# Altium schematic sheet Cockpit.SchDoc
size A4; SheetNumber: 1; SheetTotal: 1
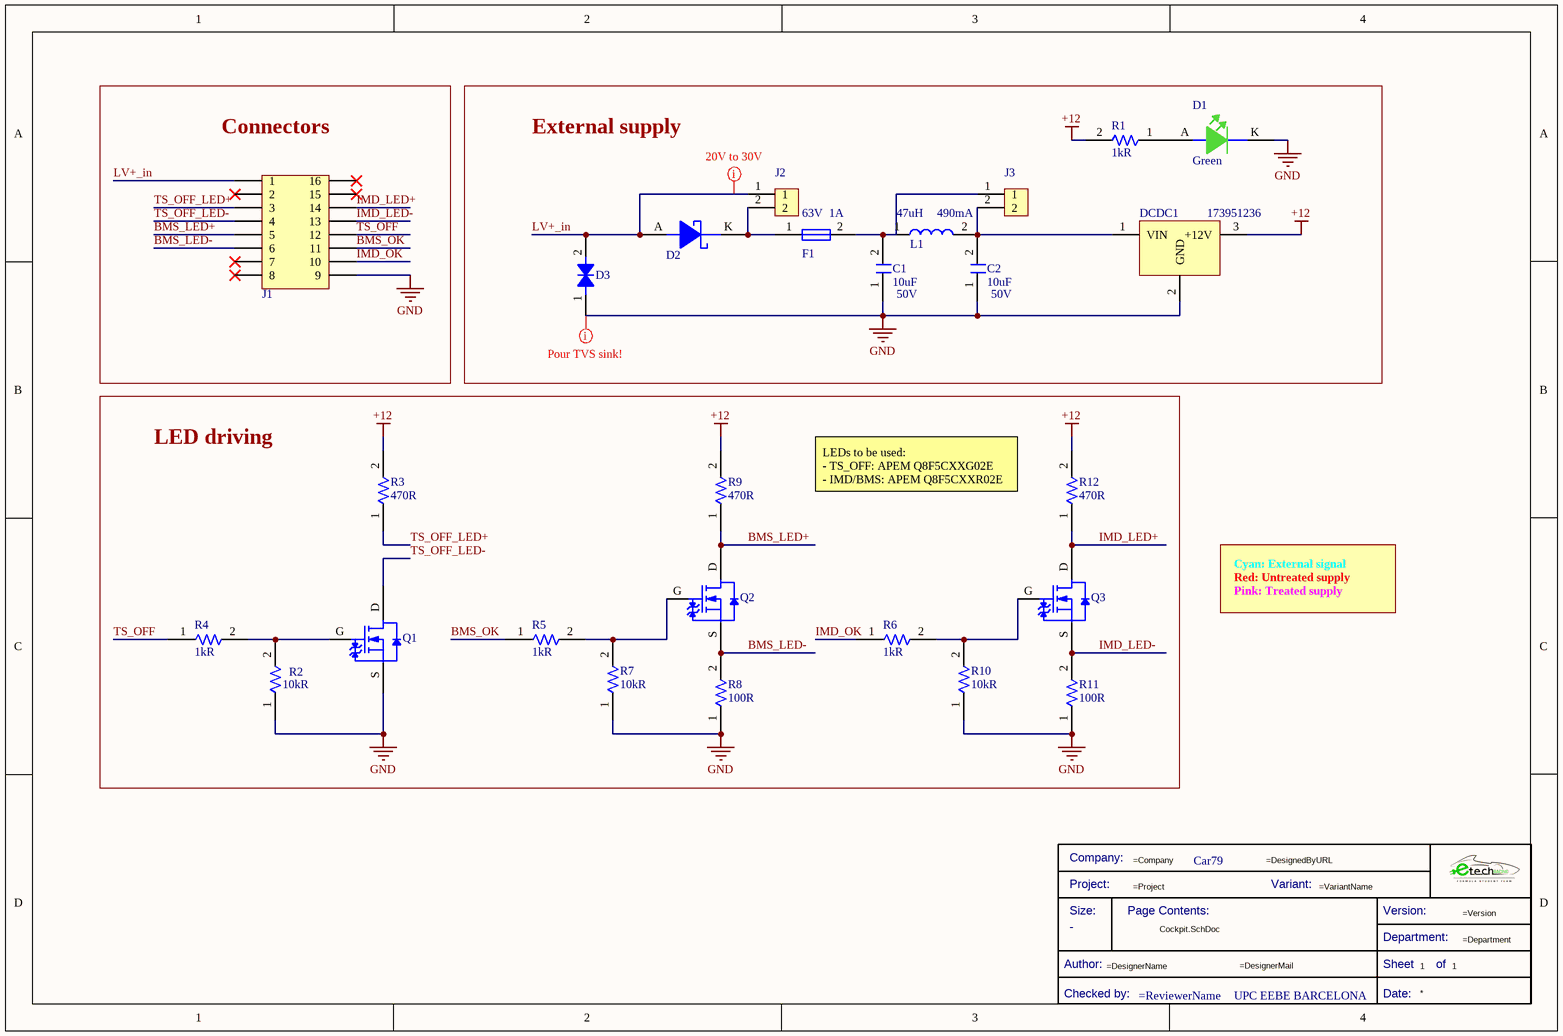
[diagram p0: Cockpit.SchDoc]

## Parts
*  Title Block_template  (value not drawn)  (graphical)
C1  Voltage Rating: 50V  Capacitance: 10uF  [C10u-50V-1210FNPMLCC-X7R]  (hidden comment: GRJ32ER71H106KE11L)
C2  Voltage Rating: 50V  Capacitance: 10uF  [C10u-50V-1210FNPMLCC-X7R]  (hidden comment: GRJ32ER71H106KE11L)
D1  Color: Green  [LED_0805_WE]  (hidden comment: 150080VS75000)
D2  MBR0530  [DSC-SOD123]  (value not drawn)
D3  824551301  [DTVS-DO-214AB]  (value not drawn)
DCDC1  173951236  [DCDC_Magi3c]
F1  Current Rating: 1A  Voltage Rating (DC): 63V  [Fuse_1206]  (hidden comment: 0437001.WRA)
J1  1053141116  [J_NanoFit_2x8]  (value not drawn)
J2  61300211121  [J_Pinheader_1x2]  (value not drawn)
J3  61300211121  [J_Pinheader_1x2]  (value not drawn)
L1  Current Rating: 490mA  Inductance: 47uH  [L_47u-490mA_CF]  (hidden comment: CDC5D23BNP-470KC)
Q1  CPH3455-TL-H  [TRT-NCH-3/35-CPH]  (value not drawn)
Q2  CPH3455-TL-H  [TRT-NCH-3/35-CPH]  (value not drawn)
Q3  CPH3455-TL-H  [TRT-NCH-3/35-CPH]  (value not drawn)
R1  Resistance: 1kR  [R0805FTK]  (hidden comment: CR0805-JW-102ELF)
R2  Resistance: 10kR  [R0805FTK]  (hidden comment: CR0805-JW-103ELF)
R3  Resistance: 470R  [R0805FTK]  (hidden comment: CR0805-FX-4700GLF)
R4  Resistance: 1kR  [R0805FTK]  (hidden comment: CR0805-JW-102ELF)
R5  Resistance: 1kR  [R0805FTK]  (hidden comment: CR0805-JW-102ELF)
R6  Resistance: 1kR  [R0805FTK]  (hidden comment: CR0805-JW-102ELF)
R7  Resistance: 10kR  [R0805FTK]  (hidden comment: CR0805-JW-103ELF)
R8  Resistance: 100R  [R0805FTK]  (hidden comment: CR0805-FX-1000ELF)
R9  Resistance: 470R  [R0805FTK]  (hidden comment: CR0805-FX-4700GLF)
R10  Resistance: 10kR  [R0805FTK]  (hidden comment: CR0805-JW-103ELF)
R11  Resistance: 100R  [R0805FTK]  (hidden comment: CR0805-FX-1000ELF)
R12  Resistance: 470R  [R0805FTK]  (hidden comment: CR0805-FX-4700GLF)

## Blocks framed on the sheet
Connectors: J1
External supply: C1 C2 D1-D3 DCDC1 F1 J2 J3 L1 R1
LED driving: Q1-Q3 R2-R12

## Nets
+12: DCDC1.3(+12V) R1.2 R3.2 R9.2 R12.2
GND: C1.1 C2.1 D1.K D3.1 DCDC1.2(GND) J1.9 Q1.S R2.1 R7.1 R8.1 R10.1 R11.1
BMS_LED+: J1.5 Q2.D R9.1
BMS_LED-: J1.6 Q2.S R8.2
BMS_OK: J1.11 R5.1
IMD_LED+: J1.14 Q3.D R12.1
IMD_LED-: J1.13 Q3.S R11.2
IMD_OK: J1.10 R6.1
LV+_in: D2.A D3.2 J1.1 J2.1
TS_OFF: J1.12 R4.1
TS_OFF_LED+: J1.3 R3.1
TS_OFF_LED-: J1.4 Q1.D
NetC1_2: C1.2 F1.2 J3.1 L1.1
NetC2_2: C2.2 DCDC1.1(VIN) J3.2 L1.2
NetD1_A: D1.A R1.1
NetD2_K: D2.K F1.1 J2.2
NetQ1_G: Q1.G R2.2 R4.2
NetQ2_G: Q2.G R5.2 R7.2
NetQ3_G: Q3.G R6.2 R10.2

Not connected (* = marked no-connect by the designer): J1 2* 7* 8* 15* 16*

## Layout directives
mark named Pour TVS sink!: GND
mark named 20V to 30V: LV+_in

## Notes on the sheet
- LEDs to be used:
  - TS_OFF: APEM Q8F5CXXG02E
  - IMD/BMS: APEM Q8F5CXXR02E
- Cyan: External signal
- Red: Untreated supply
- Pink: Treated supply
- Car79
- UPC EEBE BARCELONA
- (in symbol Title Block_template) Company:; Project:; Variant:; Size:; Page Contents:; Version:; Department:; Author:; Sheet; of; Checked by:; Date:

## Library data of the parts
* = Title Block_template: Standard Title Block; .Creator: GP; Category: Title Block; .PCBcheck: GP; .SCHcheck: GP; Checked by:: =ReviewerName; Size: -
C1 C2 = C10u-50V-1210FNPMLCC-X7R: Multilayer Ceramic Capacitors MLCC - SMD/SMT 1210 10uF 50volts X7R +/-10% Soft Term; Manufacturer: Murata; Tolerance: 10%; .Creator: DR; Supplier 1: Avnet; Manufacturer Part Number: GRJ32ER71H106KE11L; RoHS: Yes; Category: Ceramic Capacitors; Stock 1: 19000; Pricing 1: 1000=0,33327, 2000=0,32389, 4000=0,31450, 6000=0,30511, 8000=0,29572 (USD); Mount: Surface Mount; Case/Package: 1210; Case Code (Metric): 3225; Case Code (Imperial): 1210; Min Operating Temperature: -55°C; Max Operating Temperature: 125°C; Packaging: Tape and Reel; Features: Soft Termination; Length: 0.126inch; Width: 0.098inch; Thickness: 0.11inch; RoHS Compliant: Yes; ComponentLink1URL: https://eu.mouser.com/datasheet/2/281/GRJ32ER71H106KE11_01-1977929.pdf; ComponentLink1Description: Datasheet; Supplier Part Number 1: GRJ32ER71H106KE11L
D1 = LEDVS-0805-40: Led, Green, 570 Nm, 2 V, 30 Ma, 40 Mcd Rohs Compliant: Yes; Manufacturer 1: Wurth Electronics; Luminous Intensity: 40mcd; Forward Current: 30mA; Forward Voltage: 2V; Viewing Angle: 140°; Wavelength: 570nm; Lens Style: Clear,Rectangular; Test Current: 20mA; .Creator: DR; ComponentLink1Description: Datasheet; ComponentLink1URL: https://www.we-online.com/catalog/datasheet/150080VS75000.pdf; ComponentLink2Description: Where buy it; ComponentLink2URL: https://katalog.we-online.de/en/led/WL-SMCW/150080VS75000; Supplier 1: RSComponents; Manufacturer Part Number 1: 150080VS75000; RoHS: Yes; Category: LEDs; Stock 1: 850; Pricing 1: 50=0,19300, 500=0,12900, 1000=0,12300, 2000=0,11700, 4000=0,11100 (USD); Mount: Surface Mount; Case/Package: 0805; Case Code (Metric): 2012; Case Code (Imperial): 0805; Min Operating Temperature: -40°C; Max Operating Temperature: 85°C; Package Quantity: 4000; Packaging: Tape and Reel; Dominant Wavelength: 570nm; Length: 2mm; Width: 1.25mm; Height: 0.7mm; REACH SVHC: Unknown; ComponentLink3URL: https://datasheet.ciiva.com/22656/150080vs75000-22656966.pdf?src-supplier=Element14; ComponentLink3Description: https://datasheet.ciiva.com/22656/150080vs75000-22656966.pdf?src-supplier=Element14; ComponentLink4URL: https://datasheet.ciiva.com/29279/759437-da-01-en-chipled-0805-w-kl-h-gruen-150080vs7500-29279047.pdf?src-supplier=Conrad; ComponentLink4Description: https://datasheet.ciiva.com/29279/759437-da-01-en-chipled-0805-w-kl-h-gruen-150080vs7500-29279047.pdf?src-supplier=Conrad; ComponentLink5URL: https://datasheet.ciiva.com/29563/150080vs75000-29563018.pdf?src-supplier=Digi-Key; ComponentLink5Description: https://datasheet.ciiva.com/29563/150080vs75000-29563018.pdf?src-supplier=Digi-Key; Supplier Part Number 1: 8154237
D2 = DSC-0.5/30-SOD123: VR=30V IF=500mA 30pF P=410mW; Element Configuration: Single; Forward Voltage: 430mV; Peak Non-Repetitive Surge Current: 5.5A; Average Rectified Current: 500mA; Max Reverse Leakage Current: 130uA; Max Reverse Voltage (DC): 30V; Polarity: Standard; .Creator: GP; Category: Diode; ComponentLink1Description: Datasheet; ComponentLink1URL: *; ComponentLink2Description: Where buy it; ComponentLink2URL: *; Supplier 1: Newark; Stock 1: 9; Pricing 1: 1=0,34400, 10=0,23900, 100=0,12200, 500=0,10000 (USD); Mount: Surface Mount; Contact Plating: Tin,Matte; Weight: 0.03g; Package Quantity: 1; Max Surge Current: 5.5A; Forward Current: 500mA; Max Reverse Current: 130uA; Max Repetitive Reverse Voltage (Vrrm): 30V; Max Forward Surge Current (Ifsm): 5.5A; Voltage Rating (DC): 30V; Current Rating: 500mA; Output Current: 500mA; Series: -; Length: 2.7mm; Width: 1.6mm; Height: 1.03mm; Radiation Hardening: No; RoHS Compliant: Yes; REACH SVHC: No SVHC; Lead Free: Lead Free; ComponentLink3URL: https://datasheet.ciiva.com/30479/0900766b810e2512-30479401.pdf?src-supplier=RSComponents; ComponentLink3Description: https://datasheet.ciiva.com/30479/0900766b810e2512-30479401.pdf?src-supplier=RSComponents; ComponentLink4URL: https://datasheet.ciiva.com/34301/974753-34301826.pdf?src-supplier=Jameco; ComponentLink4Description: https://datasheet.ciiva.com/34301/974753-34301826.pdf?src-supplier=Jameco; ComponentLink5URL: https://datasheet.ciiva.com/910/mbr0530-910516.pdf?src-supplier=Digi-Key; ComponentLink5Description: https://datasheet.ciiva.com/910/mbr0530-910516.pdf?src-supplier=Digi-Key; ComponentLink6URL: https://datasheet.ciiva.com/25931/mbr0530-25931989.pdf?src-supplier=Avnet+Europe; ComponentLink6Description: https://datasheet.ciiva.com/25931/mbr0530-25931989.pdf?src-supplier=Avnet+Europe; ComponentLink7URL: https://datasheet.ciiva.com/8300/mbr0530-8300905.pdf?src-supplier=Avnet; ComponentLink7Description: https://datasheet.ciiva.com/8300/mbr0530-8300905.pdf?src-supplier=Avnet; ComponentLink8URL: https://datasheet.ciiva.com/17318/mbr0530-17318568.pdf?src-supplier=Future+Electronics; ComponentLink8Description: https://datasheet.ciiva.com/17318/mbr0530-17318568.pdf?src-supplier=Future+Electronics; ComponentLink9URL: https://datasheet.ciiva.com/15144/getdatasheetpartid-86760-15144598.pdf?src-supplier=Verical; ComponentLink9Description: https://datasheet.ciiva.com/15144/getdatasheetpartid-86760-15144598.pdf?src-supplier=Verical; ComponentLink10URL: https://datasheet.ciiva.com/910/mbr0530-910518.pdf?src-supplier=Digi-Key; ComponentLink10Description: https://datasheet.ciiva.com/910/mbr0530-910518.pdf?src-supplier=Digi-Key; Supplier Part Number 1: 15R3453
D3 = DTVS-40V-DO-214AB: TVS diode [Würth Elektronik] 824551301 TVS diode; Manufacturer: Wurth Electronics; Number of Bidirectional Channels: 1; Reverse Standoff Voltage: 30V; Min Breakdown Voltage: 35.05V; Clamping Voltage: 48.4V; Peak Pulse Power: 3kW; Power Line Protection: No; Polarity: Bidirectional; Peak Pulse Current: 62A; .Creator: DO; ComponentLink2Description: Where buy it; ComponentLink2URL: https://www.we-online.com/catalog/en/WE-TVSP?sq=824551301#824551301; Supplier 1: RSComponents; Manufacturer Part Number: 824551301; RoHS: Yes; Category: TVS Diodes; Stock 1: 1; Pricing 1: 10=1,72500, 50=1,54700, 100=1,45300, 250=1,35100, 500=1,15000 (USD); Mount: Surface Mount; Number of Pins: 2; Min Operating Temperature: -65°C; Max Operating Temperature: 150°C; Packaging: Cut Tape; Max Breakdown Voltage: 35.05V; Resistor Type: Zener; REACH SVHC: Unknown; RoHS Compliant: Yes; ComponentLink1URL: http://www.farnell.com/datasheets/2036459.pdf?src-supplier=Element14; ComponentLink1Description: http://www.farnell.com/datasheets/2036459.pdf?src-supplier=Element14; Supplier Part Number 1: 9217092P
DCDC1 = DCDC-36V/12V-0.5A: Fdsm Fixed Step Down Regulator M; Manufacturer 1: Wurth Electronics; Supplier 1: Digi-Key; Manufacturer Part Number 1: 173951236; RoHS: No; Category: Board Mount Modules; Stock 1: 32; Pricing 1: 1=3,29000, 10=2,99100, 20=2,81300, 30=2,63600, 43=2,39907 (USD); Supplier Part Number 1: 732-173951236-ND; ComponentLink1Description: Datasheet; ComponentLink1URL: https://www.we-online.com/catalog/datasheet/173951236.pdf
F1 = Fuse_1A_63V_1206: Fuse Chip Fast Acting 1A 63V SMD Solder Pad 1206 Ceramic T/R Automotive; Manufacturer: Littelfuse; Fuse Type: Board Mount (Cartridge Style Excluded); Approvals: CSA,cURus; .Creator: DO; Supplier 1: Digi-Key; Manufacturer Part Number: 0437001.WRA; RoHS: Yes; Category: Fuses; Stock 1: 5820; Pricing 1: 1=1,52000, 5=1,47000, 10=1,37600, 50=1,13860, 100=0,94880, 250=0,92508, 500=0,78276, 1000=0,68788 (USD); Mount: Surface Mount; Case/Package: 1206; Case Code (Imperial): 1206; Case Code (Metric): 3216; Min Operating Temperature: -55°C; Max Operating Temperature: 150°C; Packaging: Tape and Reel; Voltage Rating (AC): 63V; ComponentLink1URL: https://www.littelfuse.com/~/media/electronics/datasheets/fuses/littelfuse_fuse_437a_datasheet.pdf.pdf?src-supplier=Digi-Key; ComponentLink1Description: https://www.littelfuse.com/~/media/electronics/datasheets/fuses/littelfuse_fuse_437a_datasheet.pdf.pdf?src-supplier=Digi-Key; Supplier Part Number 1: F10001CT-ND; ComponentLink2Description: Where buy it; ComponentLink2URL: https://www.mouser.es/ProductDetail/Littelfuse/0437001WRA?qs=DXv0QSHKF4z9CJhPXjxR%252BA%3D%3D
J1 = J_NanoFit_2x8: Nano-Fit Right Angle Header Through Hole 2.50mm Pitch Dual Row 16 Circuits Tin (Sn) Plating Black; Manufacturer: Molex; Manufacturer Part Number: 105314-1116; .Creator: DO; ComponentLink1URL: https://www.molex.com/pdm_docs/ps/PS-105300-100-001.pdf?src-supplier=Digi-Key; ComponentLink1Description: https://www.molex.com/pdm_docs/ps/PS-105300-100-001.pdf?src-supplier=Digi-Key; ComponentLink2Description: Where buy it; ComponentLink2URL: https://www.molex.com/molex/products/part-detail/pcb_headers/1053141116; Supplier 1: Newark; RoHS: Yes; Category: Headers and Wire Housings; Stock 1: 366; Pricing 1: 1=3,37000, 10=3,24000, 25=2,88000, 50=2,81000, 100=2,73000, 250=2,44000 (USD); Supplier Part Number 1: 33AC7692
J2 J3 = J_Jumper: CONN HEADER 2 POS 2.54; Manufacturer: Molex; Temperature rating: -40° to +105°C; Category type: PCB-PCB; Product name: Pin Header; Maximum current: 3 A; Maximum voltage: 250 V AC; Connections: 1x2; Current Rating: 3A; Voltage Rating: 250V; Number of Positions: 2; Gender: Male; Connector Type: Male Pin; Pitch: 0.1inch; .Creator: GP; Category: Connector; ComponentLink1Description: Datasheet; ComponentLink1URL: https://www.we-online.com/catalog/datasheet/61300211121.pdf; ComponentLink2Description: Where buy it; ComponentLink2URL: https://www.we-online.com/catalog/en/PHD_2_54_THT_PIN_HEADER_6130XX11121?sq=61300211121&sp=https%3A%2F%2Fwww.we-online.com%2Fweb%2Fen%2Fwuerth_elektronik%2Fsearchpage.php%3Fsearch%3D61300211121#61300211121; Manufacturer part number: 61300211121; Supplier: Würth Elektronik; RoHS: *; Application: Shortcircuit; Flammability: 94V-0; Orientation: Vertical; Mount: Through hole; Supplier 1: RSComponents; Stock 1: 1855; Pricing 1: 5=0,14100, 50=0,09700, 100=0,07800, 200=0,07300, 500=0,06800 (USD); Contact Plating: Gold; Housing Material: PBT; Contact Material: Copper Alloy,Copper; Color: Black; Min Operating Temperature: -40°C; Max Operating Temperature: 125°C; Number of Rows: 1; Contact Gender: Male; Packaging: Bulk; Termination: Through Hole; Number of Contacts: 2; Contact Mating Length: 0.236inch; REACH SVHC: Unknown; Lead Free: Lead Free; ComponentLink3URL: https://datasheet.ciiva.com/13619/6130xx11121-48870-13619345.pdf?src-supplier=Mouser; ComponentLink3Description: https://datasheet.ciiva.com/13619/6130xx11121-48870-13619345.pdf?src-supplier=Mouser; Supplier Part Number 1: 8281581
L1 = L_47u-490mA_CF: Inductor Power Unshielded Wirewound 47uH 10% 100KHz Ferrite 490mA 546mOhm DCR T/R; Manufacturer: Sumida; DC Resistance (DCR): 546mR; .Creator: GP; Supplier 1: Mouser; Manufacturer Part Number: CDC5D23BNP-470KC; RoHS: Yes; Category: Fixed Inductors; Stock 1: 3779; Pricing 1: 1=0,95000, 10=0,71100, 50=0,71100, 100=0,59700, 1000=0,40600, 10000=0,38100 (USD); Mount: Surface Mount; Case/Package: Nonstandard; Core Material: Ferrite; Weight: 0.007584oz; Min Operating Temperature: -40°C; Max Operating Temperature: 100°C; Tolerance: 10%; Shielding: Unshielded; Packaging: Tape and Reel; Package Quantity: 2000; Max DC Current: 490mA; Termination: SMD/SMT; Test Frequency: 100kHz; Series: CDC5D23B; Length: 0.228inch; Width: 5.8mm; Height: 2.5mm; Height - Seated (Max): 0.098inch; Lead Free: Lead Free; RoHS Compliant: Yes; ComponentLink1URL: http://www.mouser.com/ds/2/390/CDC5D23B-465898.pdf?src-supplier=Mouser; ComponentLink1Description: http://www.mouser.com/ds/2/390/CDC5D23B-465898.pdf?src-supplier=Mouser; ComponentLink3URL: http://products.sumida.com/products/pdf/CDC5D23B.pdf?src-supplier=Digi-Key; ComponentLink3Description: http://products.sumida.com/products/pdf/CDC5D23B.pdf?src-supplier=Digi-Key; Supplier Part Number 1: 851-CDC5D23BNP-470KC
Q1-Q3 = TRT-NCH-3/35-CPH: CPH3455-TL-H N-channel MOSFET Transistor; 3 A; 35 V; 3-Pin CPH; Manufacturer: ON Semiconductor; Rds On Max: 104mR; Input Capacitance: 186pF; Rise Time: 4.7ns; Drain to Source Voltage (Vdss): 35V; Continuous Drain Current (ID): 3A; Max Power Dissipation: 1W; Drain to Source Resistance: 108mR; Turn-On Delay Time: 4.2ns; Turn-Off Delay Time: 15ns; Fall Time: 5.7ns; Element Configuration: Single; Gate to Source Voltage (Vgs): 20V; .Creator: GP; Category: Transistor; ComponentLink1Description: Datasheet; ComponentLink1URL: https://docs.rs-online.com/5847/0900766b812d514d.pdf; ComponentLink2Description: Where buy it; ComponentLink2URL: https://es.rs-online.com/web/p/mosfet/8009989; Supplier 1: RSComponents; Manufacturer Part Number: CPH3455-TL-H; RoHS: Yes; Stock 1: 1; Pricing 1: 50=0,50400 (USD); Case/Package: SC; Number of Pins: 3; Min Operating Temperature: -55°C; Max Operating Temperature: 150°C; Package Quantity: 3000; Packaging: Tape and Reel; Drain to Source Breakdown Voltage: 35V; Power Dissipation: 1W; Polarity: N-CHANNEL; Series: -; Length: 2.9mm; Width: 1.6mm; Height: 0.9mm; Lead Free: Lead Free; Halogen Free: Halogen Free; RoHS Compliant: Yes; ComponentLink3URL: https://datasheet.ciiva.com/947/cph3455-d-947201.pdf?src-supplier=Digi-Key; ComponentLink3Description: https://datasheet.ciiva.com/947/cph3455-d-947201.pdf?src-supplier=Digi-Key; ComponentLink4URL: https://datasheet.ciiva.com/4444/cph3455-d-91653-4444616.pdf?src-supplier=Mouser; ComponentLink4Description: https://datasheet.ciiva.com/4444/cph3455-d-91653-4444616.pdf?src-supplier=Mouser; ComponentLink5URL: https://datasheet.ciiva.com/11164/cph3455-d-11164889.pdf?src-supplier=Avnet; ComponentLink5Description: https://datasheet.ciiva.com/11164/cph3455-d-11164889.pdf?src-supplier=Avnet; Supplier Part Number 1: 8009989
R1 R4-R6 = R1k-0805FTK: Res Thick Film 0805 1K Ohm 5% 1/8W ±200ppm/°C Molded SMD SMD Paper Tape on Plastic Reel; Manufacturer 1: Bourns; Voltage Rating (DC): 150V; Power Rating: 125mW; .Creator: GP; Supplier 1: Arrow Electronics; Manufacturer Part Number 1: CR0805-JW-102ELF; RoHS: Yes; Category: Chip SMD Resistors; Stock 1: 27510; Pricing 1: 1=0,05930, 10=0,03510, 25=0,01790, 100=0,00800, 250=0,00790, 500=0,00590, 1000=0,00360, 3000=0,00350, 6000=0,00250 (USD); Mount: Surface Mount; Case/Package: 0805; Number of Pins: 2; Contact Plating: Tin; Case Code (Metric): 2012; Case Code (Imperial): 0805; Min Operating Temperature: -55°C; Max Operating Temperature: 155°C; Resistor Type: Thick Film; Tolerance: 5%; Temperature Coefficient: 200ppm/°C; Features: Moisture Resistant; Package Quantity: 1; Packaging: Tape and Reel; Voltage Rating: 150V; Number of Terminations: 2; Termination: SMD/SMT; Max Power Dissipation: 125mW; Length: 2mm; Width: 1.25mm; Height: 0.5mm; Thickness: 508um; Depth: 1.25mm; Radiation Hardening: No; Lead Free: Lead Free; REACH SVHC: No SVHC; Military Standard: Not; ComponentLink1URL: https://datasheet.ciiva.com/11821/0900766b80fcdb72-11821134.pdf?src-supplier=RSComponents; ComponentLink1Description: https://datasheet.ciiva.com/11821/0900766b80fcdb72-11821134.pdf?src-supplier=RSComponents; ComponentLink2URL: https://datasheet.ciiva.com/15225/getdatasheetpartid-78155-15225381.pdf?src-supplier=Verical; ComponentLink2Description: https://datasheet.ciiva.com/15225/getdatasheetpartid-78155-15225381.pdf?src-supplier=Verical; ComponentLink3URL: https://datasheet.ciiva.com/22693/1902866-22693253.pdf?src-supplier=Element14; ComponentLink3Description: https://datasheet.ciiva.com/22693/1902866-22693253.pdf?src-supplier=Element14; ComponentLink4URL: https://datasheet.ciiva.com/7986/1856384-7986184.pdf?src-supplier=Element14; ComponentLink4Description: https://datasheet.ciiva.com/7986/1856384-7986184.pdf?src-supplier=Element14; ComponentLink5URL: https://datasheet.ciiva.com/7985/1856384-7985867.pdf?src-supplier=Element14; ComponentLink5Description: https://datasheet.ciiva.com/7985/1856384-7985867.pdf?src-supplier=Element14; ComponentLink6URL: https://datasheet.ciiva.com/30242/159chpreztr-30242765.pdf?src-supplier=Onlinecomponents.com; ComponentLink6Description: https://datasheet.ciiva.com/30242/159chpreztr-30242765.pdf?src-supplier=Onlinecomponents.com; ComponentLink7URL: https://datasheet.ciiva.com/6547/chpreztr-6547359.pdf?src-supplier=Digi-Key; ComponentLink7Description: https://datasheet.ciiva.com/6547/chpreztr-6547359.pdf?src-supplier=Digi-Key; Supplier Part Number 1: CR0805-JW-102ELF
R2 R7 R10 = R10k-0805FTK: BOURNS         CR0805-JW-103ELF            Surface Mount Chip Resistor, Thick Film, CR Series, 10 kohm, 125 mW,  5%, 150 V; Temperature Coefficient: 200ppm/°C; Power Rating: 125mW; Voltage Rating: 150V; Voltage Rating (DC): 100V; .Creator: DR; Supplier 1: Arrow Electronics; Manufacturer 1: Bourns; Manufacturer Part Number 1: CR0805-JW-103ELF; RoHS: Yes; Category: Chip SMD Resistors; Stock 1: 57566; Pricing 1: 1=0,05790, 10=0,01540, 25=0,01340, 100=0,00340 (USD); Mount: Surface Mount; Case/Package: 0805; Number of Pins: 2; Contact Plating: Tin; Case Code (Metric): 2012; Case Code (Imperial): 0805; Min Operating Temperature: -55°C; Max Operating Temperature: 155°C; Tolerance: 5%; Resistor Type: Thick Film; Package Quantity: 1; Packaging: Tape and Reel; Number of Terminations: 2; Termination: SMD/SMT; Max Power Dissipation: 125mW; Features: Moisture Resistant; Series: CR0805; Construction: Rectangular; Resistance Tolerance: 5%; Technology: THICK FILM; Length: 2mm; Width: 1.25mm; Height: 0.5mm; Depth: 1.25mm; Thickness: 508um; Radiation Hardening: No; REACH SVHC: No SVHC; Military Standard: Not; RoHS Compliant: Yes; ComponentLink1URL: https://datasheet.ciiva.com/11821/0900766b80fcdb72-11821135.pdf?src-supplier=RSComponents; ComponentLink1Description: https://datasheet.ciiva.com/11821/0900766b80fcdb72-11821135.pdf?src-supplier=RSComponents; ComponentLink2URL: https://datasheet.ciiva.com/9122/chpreztr-9122374.pdf?src-supplier=Avnet; ComponentLink2Description: https://datasheet.ciiva.com/9122/chpreztr-9122374.pdf?src-supplier=Avnet; ComponentLink3URL: https://datasheet.ciiva.com/22693/1902866-22693254.pdf?src-supplier=Element14; ComponentLink3Description: https://datasheet.ciiva.com/22693/1902866-22693254.pdf?src-supplier=Element14; ComponentLink4URL: https://datasheet.ciiva.com/7986/691949-7986187.pdf?src-supplier=Element14; ComponentLink4Description: https://datasheet.ciiva.com/7986/691949-7986187.pdf?src-supplier=Element14; ComponentLink5URL: https://datasheet.ciiva.com/30065/159chpreztr-30065976.pdf?src-supplier=Onlinecomponents.com; ComponentLink5Description: https://datasheet.ciiva.com/30065/159chpreztr-30065976.pdf?src-supplier=Onlinecomponents.com; ComponentLink6URL: https://datasheet.ciiva.com/16783/70154685-16783482.pdf?src-supplier=Allied+Electronics; ComponentLink6Description: https://datasheet.ciiva.com/16783/70154685-16783482.pdf?src-supplier=Allied+Electronics; ComponentLink7URL: https://datasheet.ciiva.com/5548/chpreztr-5548491.pdf?src-supplier=Mouser; ComponentLink7Description: https://datasheet.ciiva.com/5548/chpreztr-5548491.pdf?src-supplier=Mouser; ComponentLink8URL: https://datasheet.ciiva.com/6559/chpreztr-6559900.pdf?src-supplier=Digi-Key; ComponentLink8Description: https://datasheet.ciiva.com/6559/chpreztr-6559900.pdf?src-supplier=Digi-Key; ComponentLink9URL: https://datasheet.ciiva.com/6559/chpreztr-6559901.pdf?src-supplier=Digi-Key; ComponentLink9Description: https://datasheet.ciiva.com/6559/chpreztr-6559901.pdf?src-supplier=Digi-Key; ComponentLink10URL: https://datasheet.ciiva.com/7985/1856384-7985869.pdf?src-supplier=Element14; ComponentLink10Description: https://datasheet.ciiva.com/7985/1856384-7985869.pdf?src-supplier=Element14; ComponentLink11URL: https://datasheet.ciiva.com/48692/001055517-da-01-en-smd-wid-cr0805-jw-103elf-10k-ohm-1-8w-48692118.pdf?src-supplier=Conrad; ComponentLink11Description: https://datasheet.ciiva.com/48692/001055517-da-01-en-smd-wid-cr0805-jw-103elf-10k-ohm-1-8w-48692118.pdf?src-supplier=Conrad; Supplier Part Number 1: CR0805-JW-103ELF
R3 R9 R12 = R470-0805FTK: Res Thick Film 0805 470 Ohm 1% 1/8W ±100ppm/°C Molded SMD SMD Paper Tape on Plastic Reel; Manufacturer 1: Bourns; Power Rating: 125mW; Voltage Rating: 150V; .Creator: DR; Supplier 1: Arrow Electronics; Manufacturer Part Number 1: CR0805-FX-4700GLF; RoHS: Yes; Category: Chip SMD Resistors; Stock 1: 12623; Pricing 1: 1=0,00990, 10=0,00980, 25=0,00950, 50=0,00940, 100=0,00930, 250=0,00920, 500=0,00910, 1000=0,00890, 3000=0,00870, 6000=0,00860 (USD); Mount: Surface Mount; Case/Package: 0805; Number of Pins: 2; Case Code (Imperial): 0805; Case Code (Metric): 2012; Contact Plating: Tin; Min Operating Temperature: -55°C; Max Operating Temperature: 155°C; Packaging: Tape and Reel; Tolerance: 1%; Resistor Type: Thick Film; Termination: SMD/SMT; Temperature Coefficient: 100ppm/°C; Voltage Rating (DC): 150V; Features: Moisture Resistant; Series: CR0805; Max Power Dissipation: 125mW; Number of Terminations: 2; Resistance Tolerance: 1%; Construction: Rectangular; Technology: THICK FILM; Length: 2mm; Height: 0.5mm; Depth: 1.25mm; Thickness: 508um; Radiation Hardening: No; REACH SVHC: No SVHC; Military Standard: Not; ComponentLink1URL: https://datasheet.ciiva.com/11808/0900766b80fcdb72-11808686.pdf?src-supplier=RSComponents; ComponentLink1Description: https://datasheet.ciiva.com/11808/0900766b80fcdb72-11808686.pdf?src-supplier=RSComponents; ComponentLink2URL: https://datasheet.ciiva.com/7985/1856384-7985880.pdf?src-supplier=Element14; ComponentLink2Description: https://datasheet.ciiva.com/7985/1856384-7985880.pdf?src-supplier=Element14; ComponentLink3URL: https://datasheet.ciiva.com/22693/1902866-22693247.pdf?src-supplier=Element14; ComponentLink3Description: https://datasheet.ciiva.com/22693/1902866-22693247.pdf?src-supplier=Element14; ComponentLink4URL: https://datasheet.ciiva.com/5541/chpreztr-5541930.pdf?src-supplier=Mouser; ComponentLink4Description: https://datasheet.ciiva.com/5541/chpreztr-5541930.pdf?src-supplier=Mouser; Supplier Part Number 1: CR0805-FX-4700GLF
R8 R11 = R100-0805FTK: Res Thick Film 0805 100 Ohm 1% 1/8W ±100ppm/°C Molded SMD SMD Paper Tape on Plastic Reel; Manufacturer 1: Bourns; Power Rating: 125mW; Voltage Rating: 150V; .Creator: DR; Supplier 1: Arrow Electronics; Manufacturer Part Number 1: CR0805-FX-1000ELF; RoHS: Yes; Category: Chip SMD Resistors; Stock 1: 49802; Pricing 1: 1=0,05840, 10=0,03430, 25=0,01780, 100=0,00750, 250=0,00560, 500=0,00490, 3000=0,00470 (USD); Mount: Surface Mount; Case/Package: 0805; Number of Pins: 2; Contact Plating: Tin; Case Code (Imperial): 0805; Case Code (Metric): 2012; Min Operating Temperature: -55°C; Max Operating Temperature: 155°C; Tolerance: 1%; Resistor Type: Thick Film; Temperature Coefficient: 100ppm/°C; Packaging: Tape and Reel; Package Quantity: 1; Termination: SMD/SMT; Number of Terminations: 2; Max Power Dissipation: 125mW; Voltage Rating (DC): 150V; Features: Moisture Resistant; Series: CR0805; Resistance Tolerance: 1%; Construction: Rectangular; Technology: THICK FILM; Length: 2mm; Width: 1.25mm; Height: 0.5mm; Depth: 1.25mm; Thickness: 508um; Radiation Hardening: No; REACH SVHC: No SVHC; Military Standard: Not; RoHS Compliant: Yes; ComponentLink1URL: https://datasheet.ciiva.com/11809/0900766b80fcdb72-11809178.pdf?src-supplier=RSComponents; ComponentLink1Description: https://datasheet.ciiva.com/11809/0900766b80fcdb72-11809178.pdf?src-supplier=RSComponents; ComponentLink2URL: https://datasheet.ciiva.com/6547/chpreztr-6547413.pdf?src-supplier=Digi-Key; ComponentLink2Description: https://datasheet.ciiva.com/6547/chpreztr-6547413.pdf?src-supplier=Digi-Key; ComponentLink3URL: https://datasheet.ciiva.com/6547/chpreztr-6547414.pdf?src-supplier=Digi-Key; ComponentLink3Description: https://datasheet.ciiva.com/6547/chpreztr-6547414.pdf?src-supplier=Digi-Key; ComponentLink4URL: https://datasheet.ciiva.com/6547/chpreztr-6547415.pdf?src-supplier=Digi-Key; ComponentLink4Description: https://datasheet.ciiva.com/6547/chpreztr-6547415.pdf?src-supplier=Digi-Key; ComponentLink5URL: https://datasheet.ciiva.com/9120/chpreztr-9120744.pdf?src-supplier=Avnet; ComponentLink5Description: https://datasheet.ciiva.com/9120/chpreztr-9120744.pdf?src-supplier=Avnet; Supplier Part Number 1: CR0805-FX-1000ELF